# Altium project TAUV-PHOD-Board.PrjPcb
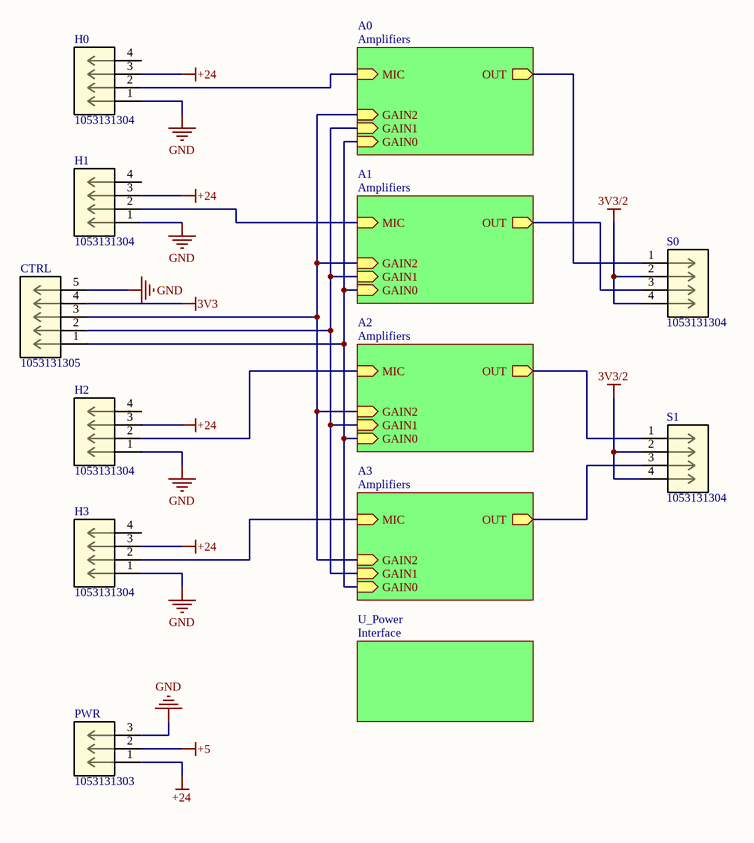
[diagram p0: Main.SchDoc]
3 sheets, 102 parts. Net scope: hierarchical (ports join the sheet entries above them; power ports are global).
Board file: TAUV-PHOD-Board.PcbDoc
Sheets:
  Main.SchDoc
    U_Power = Interface.SchDoc
    A0 = Amplifiers.SchDoc
    A1 = Amplifiers.SchDoc
    A2 = Amplifiers.SchDoc
    A3 = Amplifiers.SchDoc

## Sheet Main.SchDoc
size A; SheetNumber: 1; SheetTotal: 3

### Parts
CTRL  1053131305  [CON_1053131305]
H0  1053131304  [CON_1053131304]
H1  1053131304  [CON_1053131304]
H2  1053131304  [CON_1053131304]
H3  1053131304  [CON_1053131304]
PWR  1053131303  [CON_1053131303]
S0  1053131304  [CON_1053131304]
S1  1053131304  [CON_1053131304]

### Sub-sheets
A0 = Amplifiers: GAIN0 (in), GAIN1 (in), GAIN2 (in), MIC (in), OUT (out)
A1 = Amplifiers: GAIN0 (in), GAIN1 (in), GAIN2 (in), MIC (in), OUT (out)
A2 = Amplifiers: GAIN0 (in), GAIN1 (in), GAIN2 (in), MIC (in), OUT (out)
A3 = Amplifiers: GAIN0 (in), GAIN1 (in), GAIN2 (in), MIC (in), OUT (out)
U_Power = Interface: no entries

### Nets
3V3: CTRL.4
3V3/2: S0.2 S0.4 S1.2 S1.4
+5: PWR.2
+24: H0.3 H1.3 H2.3 H3.3 PWR.1
GND: CTRL.5 H0.1 H1.1 H2.1 H3.1 PWR.3
NetC1_A0_1: H0.2 ; sheet A0/MIC
NetC1_A1_1: H1.2 ; sheet A1/MIC
NetC1_A2_1: H2.2 ; sheet A2/MIC
NetC1_A3_1: H3.2 ; sheet A3/MIC
NetCTRL_1: CTRL.1 ; sheet A0/GAIN0, sheet A1/GAIN0, sheet A2/GAIN0, sheet A3/GAIN0
NetCTRL_2: CTRL.2 ; sheet A0/GAIN1, sheet A1/GAIN1, sheet A2/GAIN1, sheet A3/GAIN1
NetCTRL_3: CTRL.3 ; sheet A0/GAIN2, sheet A1/GAIN2, sheet A2/GAIN2, sheet A3/GAIN2
NetS0_1: S0.1 ; sheet A0/OUT
NetS0_3: S0.3 ; sheet A1/OUT
NetS1_1: S1.1 ; sheet A2/OUT
NetS1_3: S1.3 ; sheet A3/OUT

Not connected (* = marked no-connect by the designer): H0 4; H1 4; H2 4; H3 4

### Library data of the parts
CTRL = 1053131305: No Description Available; Mfr_Name: Molex Connector Corporation; Copyright: Copyright (C) 2023 Ultra Librarian. All rights reserved.; Manufacturer_Part_Number: 1053131305; RefDes: RefDes; Type: DEV
H0-H3 S0 S1 = 1053131304: No Description Available; Mfr_Name: Molex Connector Corporation; Copyright: Copyright (C) 2023 Ultra Librarian. All rights reserved.; Manufacturer_Part_Number: 1053131304; RefDes: RefDes; Type: DEV
PWR = 1053131303: No Description Available; Mfr_Name: Molex Connector Corporation; Copyright: Copyright (C) 2023 Ultra Librarian. All rights reserved.; Manufacturer_Part_Number: 1053131303; RefDes: RefDes; Type: DEV

## Sheet Interface.SchDoc
size A; SheetNumber: 3; SheetTotal: 3
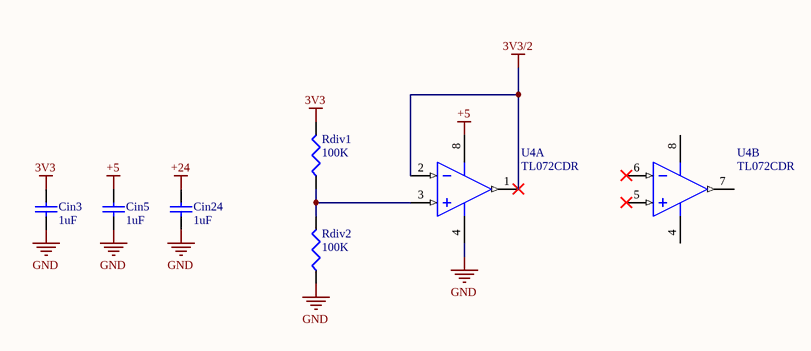
[diagram p1: Interface.SchDoc]

### Parts
Cin3  1uF  [C0805]
Cin5  1uF  [C0805]
Cin24  1uF  [C0805]
Rdiv1  100K  [J1-0603]
Rdiv2  100K  [J1-0603]
U4  TL072CDR  [D0008A_M]  (parts A,B of 2)

### Nets
3V3: Cin3.2 Rdiv1.2
3V3/2: U4.1(OUT1) U4.2(IN1-)
+5: Cin5.2 U4.8(VCC+)
+24: Cin24.2
GND: Cin3.1 Cin5.1 Cin24.1 Rdiv2.1 U4.4(VCC-)
NetRdiv1_1: Rdiv1.1 Rdiv2.2 U4.3(IN1+)

Not connected (* = marked no-connect by the designer): U4 5(IN2+)* 6(IN2-)* 7(OUT2)

### Library data of the parts
Cin3 Cin5 Cin24 = Cap: Capacitor; Published: 8-Jun-2000; LatestRevisionDate: 17-Jul-2002; LatestRevisionNote: Re-released for DXP Platform.; PackageReference: RAD-0.3; Publisher: Altium Limited; PackageDescription: Radial Cap, Thru-Hole; 2 Leads; 0.3 in Pin Spacing
Rdiv1 Rdiv2 = Res3: Resistor; Published: 8-Jun-2000; LatestRevisionDate: 29-May-2009; LatestRevisionNote: IPC-7351 Footprint Added.; PackageReference: J1-0603; Publisher: Altium Limited; PackageDescription: Chip Resistor
U4 = CMP-0017-00628-2: Dual Low-Noise JFET-Input General-Purpose Operational Amplifier, 7 to 36 V, 0 to 70 degC, 8-pin SOIC (D8), Green (RoHS & no Sb/Br); Manufacturer: Texas Instruments; Total Supply Voltage(Min)(+5V is 5, +/-5V is 10): 7; IIB(Max)(pA): 200; Sub Family: General Purpose Amplifier, High Supply Voltage Amplifier (>=30V); Number of Channels: 2; Iq per channel(Max)(mA): 2.5; Total Supply Voltage(Max)(+5V is 5, +/-5V is 10): 36; Vio (25C)(Max)(mV): 10; Offset Drift(Typ)(uV/C): 18; CMRR(Min)(dB): 70; Rating: Catalog; Slew Rate(Typ)(V/us): 13; GBW(Typ)(MHz): 3; ComponentLink1Description: Manufacturer URL; Code_JEDEC: MS-012; ComponentLink3Description: Package Specification; Mounting Technology: Surface Mount; Eco-Plan: Green (RoHS & no Sb/Br); ComponentLink3URL: http://www.ti.com/litv/pdf/msoi002j; ComponentLink1URL: http://www.ti.com/; PackageVersion: 4040047-3/M, 06/2011; ComponentLink2URL: http://www.ti.com/lit/ds/symlink/tl072.pdf; PartNumber: TL072CDR; PackageDescription: 8-Pin Plastic Small Outline, Body 4.9 x 3.9 mm, Pitch 1.27 mm; DatasheetVersion: SLOS080J; Vn at 1kHz(Typ)(nV/rtHz): 18; ComponentLink2Description: Datasheet; PackageReference: D0008A

## Sheet Amplifiers.SchDoc
size A; SheetNumber: 2; SheetTotal: 3; SPICEModelCacheSKPNOQXM: <root> / <DocumentId>SKPNOQXM</DocumentId> / </root>
Used 4 times, as channels A0, A1, A2, A3. Parts and nets are listed once, with the designators drawn on the sheet.
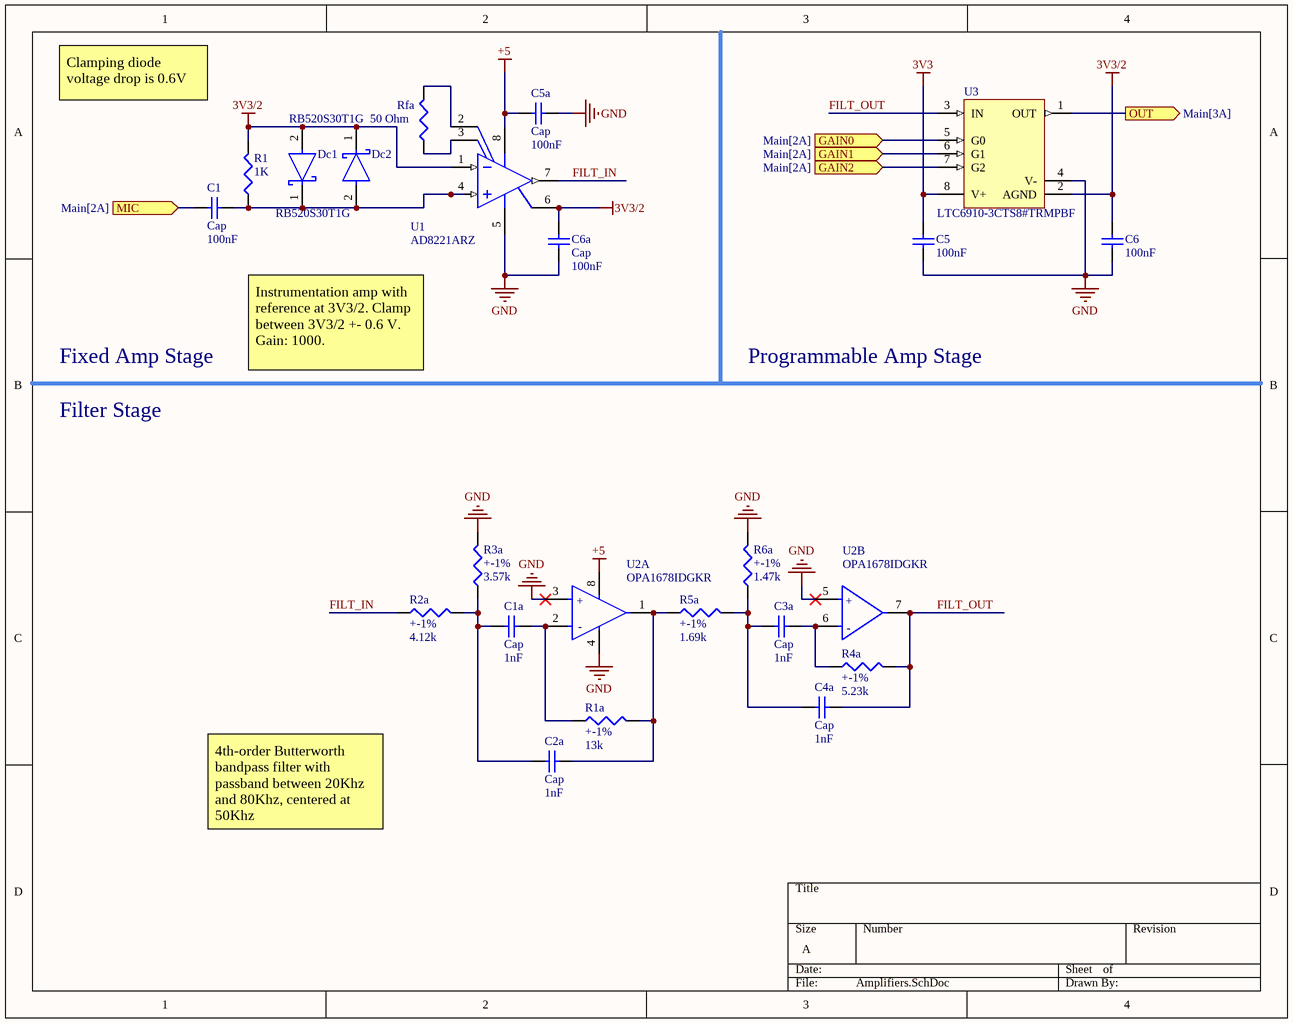
[diagram p2: Amplifiers.SchDoc]

### Parts
C1  Cap  value 100nF  [C0805]
C1a  Cap  value 1nF  [C0805]
C2a  Cap  value 1nF  [C0805]
C3a  Cap  value 1nF  [C0805]
C4a  Cap  value 1nF  [C0805]
C5  100nF  [C0805]
C5a  Cap  value 100nF  [C0805]
C6  100nF  [C0805]
C6a  Cap  value 100nF  [C0805]
Dc1  RB520S30T1G  [FP-502-01-MFG]
Dc2  RB520S30T1G  [FP-502-01-MFG]
R1  1K  [J1-0603]
R1a  +-1%  value 13k  [J1-0603]
R2a  +-1%  value 4.12k  [J1-0603]
R3a  +-1%  value 3.57k  [J1-0603]
R4a  +-1%  value 5.23k  [J1-0603]
R5a  +-1%  value 1.69k  [J1-0603]
R6a  +-1%  value 1.47k  [J1-0603]
Rfa  50 Ohm  [J1-0603]
U1  AD8221ARZ  [ADI-R-8_M]
U2  OPA1678IDGKR  [FP-DGK0008A-IPC_C]  (parts A,B of 2)
U3  LTC6910-3CTS8#TRMPBF  [LT-TS8-8-TSOT-23_V]

### Ports
GAIN0 (in, see Main[2A]), GAIN1 (in, see Main[2A]), GAIN2 (in, see Main[2A]), MIC (in, see Main[2A]), OUT (out, see Main[3A])

### Nets
3V3: C5.2 U3.8(V+)
3V3/2: C6.2 C6a.2 Dc1.2(A) Dc2.1(C) R1.2 U1.1(IN-) U1.6(REF) U3.2(AGND)
+5: C5a.1 U1.8(VS+) U2.8(V+)
GND: C5.1 C5a.2 C6.1 C6a.1 R3a.2 R6a.2 U1.5(VS-) U2.3(+IN_A) U2.4(V-) U2.5(+IN_B) U3.4(V-)
FILT_IN: R2a.1 U1.7(VOUT)
FILT_OUT: C4a.2 R4a.2 U2.7(OUT_B) U3.3(IN)
GAIN0: U3.5(G0) ; port GAIN0
GAIN1: U3.6(G1) ; port GAIN1
GAIN2: U3.7(G2) ; port GAIN2
MIC: C1.1 ; port MIC
OUT: U3.1(OUT) ; port OUT
NetC1_2: C1.2 Dc1.1(C) Dc2.2(A) R1.1 U1.4(IN+)
NetC1a_1: C1a.1 C2a.1 R2a.2 R3a.1
NetC1a_2: C1a.2 R1a.1 U2.2(-IN_A)
NetC2a_2: C2a.2 R1a.2 R5a.1 U2.1(OUT_A)
NetC3a_1: C3a.1 C4a.1 R5a.2 R6a.1
NetC3a_2: C3a.2 R4a.1 U2.6(-IN_B)
NetRfa_1: Rfa.1 U1.3(RG)
NetRfa_2: Rfa.2 U1.2(RG)

### Channels
A0: designators end in _A0; ports GAIN0=NetCTRL_1 GAIN1=NetCTRL_2 GAIN2=NetCTRL_3 MIC=NetC1_A0_1 OUT=NetS0_1
A1: designators end in _A1; ports GAIN0=NetCTRL_1 GAIN1=NetCTRL_2 GAIN2=NetCTRL_3 MIC=NetC1_A1_1 OUT=NetS0_3
A2: designators end in _A2; ports GAIN0=NetCTRL_1 GAIN1=NetCTRL_2 GAIN2=NetCTRL_3 MIC=NetC1_A2_1 OUT=NetS1_1
A3: designators end in _A3; ports GAIN0=NetCTRL_1 GAIN1=NetCTRL_2 GAIN2=NetCTRL_3 MIC=NetC1_A3_1 OUT=NetS1_3

### Notes on the sheet
- Clamping diode voltage drop is 0.6V
- Fixed Amp Stage
- Instrumentation amp with reference at 3V3/2. Clamp between 3V3/2 +- 0.6 V. Gain: 1000.
- Programmable Amp Stage
- Filter Stage
- 4th-order Butterworth bandpass filter with passband between 20Khz and 80Khz, centered at 50Khz
- (in symbol CMP-04894-000014-1, part A) +; -
- (in symbol CMP-04894-000014-1, part B) +; -

### Library data of the parts
C1 C1a C2a C3a C4a C5 C5a C6 C6a = Cap: Capacitor; Published: 8-Jun-2000; LatestRevisionDate: 17-Jul-2002; LatestRevisionNote: Re-released for DXP Platform.; PackageReference: RAD-0.3; Publisher: Altium Limited; PackageDescription: Radial Cap, Thru-Hole; 2 Leads; 0.3 in Pin Spacing
Dc1 Dc2 = CMP-1055-00482-2: DIODE SCHOTTKY 30V 200MA SOD523; Element Configuration: Single; Max Reverse Leakage Current: 1uA; Power Dissipation: 200mW; Forward Voltage: 600mV; Polarity: Standard; Min Operating Temperature: -55°C; Radiation Hardening: No; Average Rectified Current: 200mA; Height: 0.7mm; Package Quantity: 1; Number of Pins: 2; Forward Current: 200mA; Packaging: Tape and Reel; Max Repetitive Reverse Voltage (Vrrm): 30V; Max Forward Surge Current (Ifsm): 200mA; Peak Reverse Current: 1uA; Max Reverse Voltage (DC): 30V; Lead Free: Lead Free; Current Rating: 200mA; Output Current: 200mA; Contact Plating: Tin; Voltage Rating (DC): 30V; Max Operating Temperature: 150°C; Width: 0.9mm; REACH SVHC: No SVHC; Case/Package: SOD-523-2; Length: 1.3mm
R1 R1a R2a R3a R4a R5a R6a Rfa = Res3: Resistor; Published: 8-Jun-2000; LatestRevisionDate: 29-May-2009; LatestRevisionNote: IPC-7351 Footprint Added.; PackageReference: J1-0603; Publisher: Altium Limited; PackageDescription: Chip Resistor
U1 = CMP-0934-00045-1: Precision Instrumentation Amplifier, 2 V/us, -40 to 125 degC, 8-Pin SOIC (R-8), RoHS, Tube; Manufacturer: Analog Devices; Quiescent Current: 0.9 mA Typ.; Slew Rate@G: 1=2 V/us Typ.; -3dB Bandwidth@G: 1=825 kHz; VIO: 60 uV Max.; PackageDescription: 8-Pin Standard Small Outline Package, Body 4.9 x 3.9 mm, Pitch 1.27 mm; PackageVersion: Jun-06; Mounting Technology: Surface Mount; ComponentLink1Description: Manufacturer URL; ComponentLink1URL: http://www.analog.com/en/index.html; RoHS: TRUE; ComponentLink2URL: http://www.analog.com/static/imported-files/data_sheets/AD8221.pdf; DatasheetVersion: Rev. C; ComponentLink3Description: Package Specification; Packing: Tube; Temperature Range: -40 to 125 degC; ComponentLink3URL: http://www.analog.com/static/imported-files/packages/PKG_PDF/SOIC_Narrow%20(R)/R_8.pdf; ComponentLink2Description: Datasheet; PartNumber: AD8221ARZ
U2 = CMP-04894-000014-1: IC AUDIO 2 CIRCUIT 8VSSOP; Input Offset Voltage (Vos): 500uV; Number of Circuits: 2; Operating Supply Current: 2mA; Input Bias Current: 10pA; Gain Bandwidth Product: 16MHz; Slew Rate: 9V/µs; Max Operating Temperature: 85°C; Mount: Surface Mount; Min Operating Temperature: -40°C; Case/Package: VSSOP; Packaging: Cut Tape; Number of Channels: 2; RoHS Compliant: Yes
U3 = CMP-0359-03724-2: Single Channel, Digitally Controlled Programmable Gain Amplifier, 11 MHz Typical GBW, 16 V/us Typical SR, 2.7 to 11 V, 8-Pin SOT23 (TS8-8), Commercial, Pb-Free, Mini Reel; Manufacturer: Linear Technology; Is (mA) Typical: 2; Vs Max (V): 11; Channels (#): 1; Vs Min (V): 2.7; SR (V/us) Typical: 16; Vos (mV) Typical: 3; PackageVersion: Rev A; PackageReference: LT-TS8-8-TSOT-23; ComponentLink3Description: Package Specification; DatasheetVersion: Rev. A; ComponentLink3URL: http://cds.linear.com/docs/en/packaging/SOT_8_05-08-1637.pdf; Mounting Technology: Surface Mount; Code_JEDEC: MO-193; RoHS: Pb-Free; Linear Technology Part Number: LTC6910-3; ComponentLink2URL: http://cds.linear.com/docs/en/datasheet/6910123fa.pdf; ComponentLink1URL: http://www.linear.com/; Type: PGA; ComponentLink2Description: Datasheet; Packing: Mini Reel; RevisionNote: URLs updated; ComponentLink1Description: Manufacturer URL; PackageDescription: 8-Lead Plastic TSOT-23, Body 2.9 x 1.63 mm, Pitch 0.65 mm; PartNumber: LTC6910-3CTS8#TRMPBF; GBW (MHz) Typical: 11

## Nets that join several sheets
3V3: Main (CTRL.4), Interface (Cin3.2 Rdiv1.2), A0 (C5_A0.2 U3_A0.8), A1 (C5_A1.2 U3_A1.8), A2 (C5_A2.2 U3_A2.8), A3 (C5_A3.2 U3_A3.8)
3V3/2: Main (S0.2 S0.4 S1.2 S1.4), Interface (U4.1 U4.2), A0 (8 pins), A1 (8 pins), A2 (8 pins), A3 (8 pins)
+5: Main (PWR.2), Interface (Cin5.2 U4.8), A0 (C5a_A0.1 U1_A0.8 U2_A0.8), A1 (C5a_A1.1 U1_A1.8 U2_A1.8), A2 (C5a_A2.1 U1_A2.8 U2_A2.8), A3 (C5a_A3.1 U1_A3.8 U2_A3.8)
+24: Main (5 pins), Interface (Cin24.2)
GND: Main (6 pins), Interface (5 pins), A0 (11 pins), A1 (11 pins), A2 (11 pins), A3 (11 pins)
NetC1_A0_1: Main (H0.2), A0 (C1_A0.1)
NetC1_A1_1: Main (H1.2), A1 (C1_A1.1)
NetC1_A2_1: Main (H2.2), A2 (C1_A2.1)
NetC1_A3_1: Main (H3.2), A3 (C1_A3.1)
NetCTRL_1: Main (CTRL.1), A0 (U3_A0.5), A1 (U3_A1.5), A2 (U3_A2.5), A3 (U3_A3.5)
NetCTRL_2: Main (CTRL.2), A0 (U3_A0.6), A1 (U3_A1.6), A2 (U3_A2.6), A3 (U3_A3.6)
NetCTRL_3: Main (CTRL.3), A0 (U3_A0.7), A1 (U3_A1.7), A2 (U3_A2.7), A3 (U3_A3.7)
NetS0_1: Main (S0.1), A0 (U3_A0.1)
NetS0_3: Main (S0.3), A1 (U3_A1.1)
NetS1_1: Main (S1.1), A2 (U3_A2.1)
NetS1_3: Main (S1.3), A3 (U3_A3.1)